# EasyEDA Pro project Schematic.epro

# Schematic Schematic1
Board Name: Board1; Create Date: 2026-08-19; Page Name: P1; Project Name: squid card; Schematic Name: Schematic1; Update Date: 2026-08-19; Company: EasyEDA.com; Page Size: A4; Version: V1.0
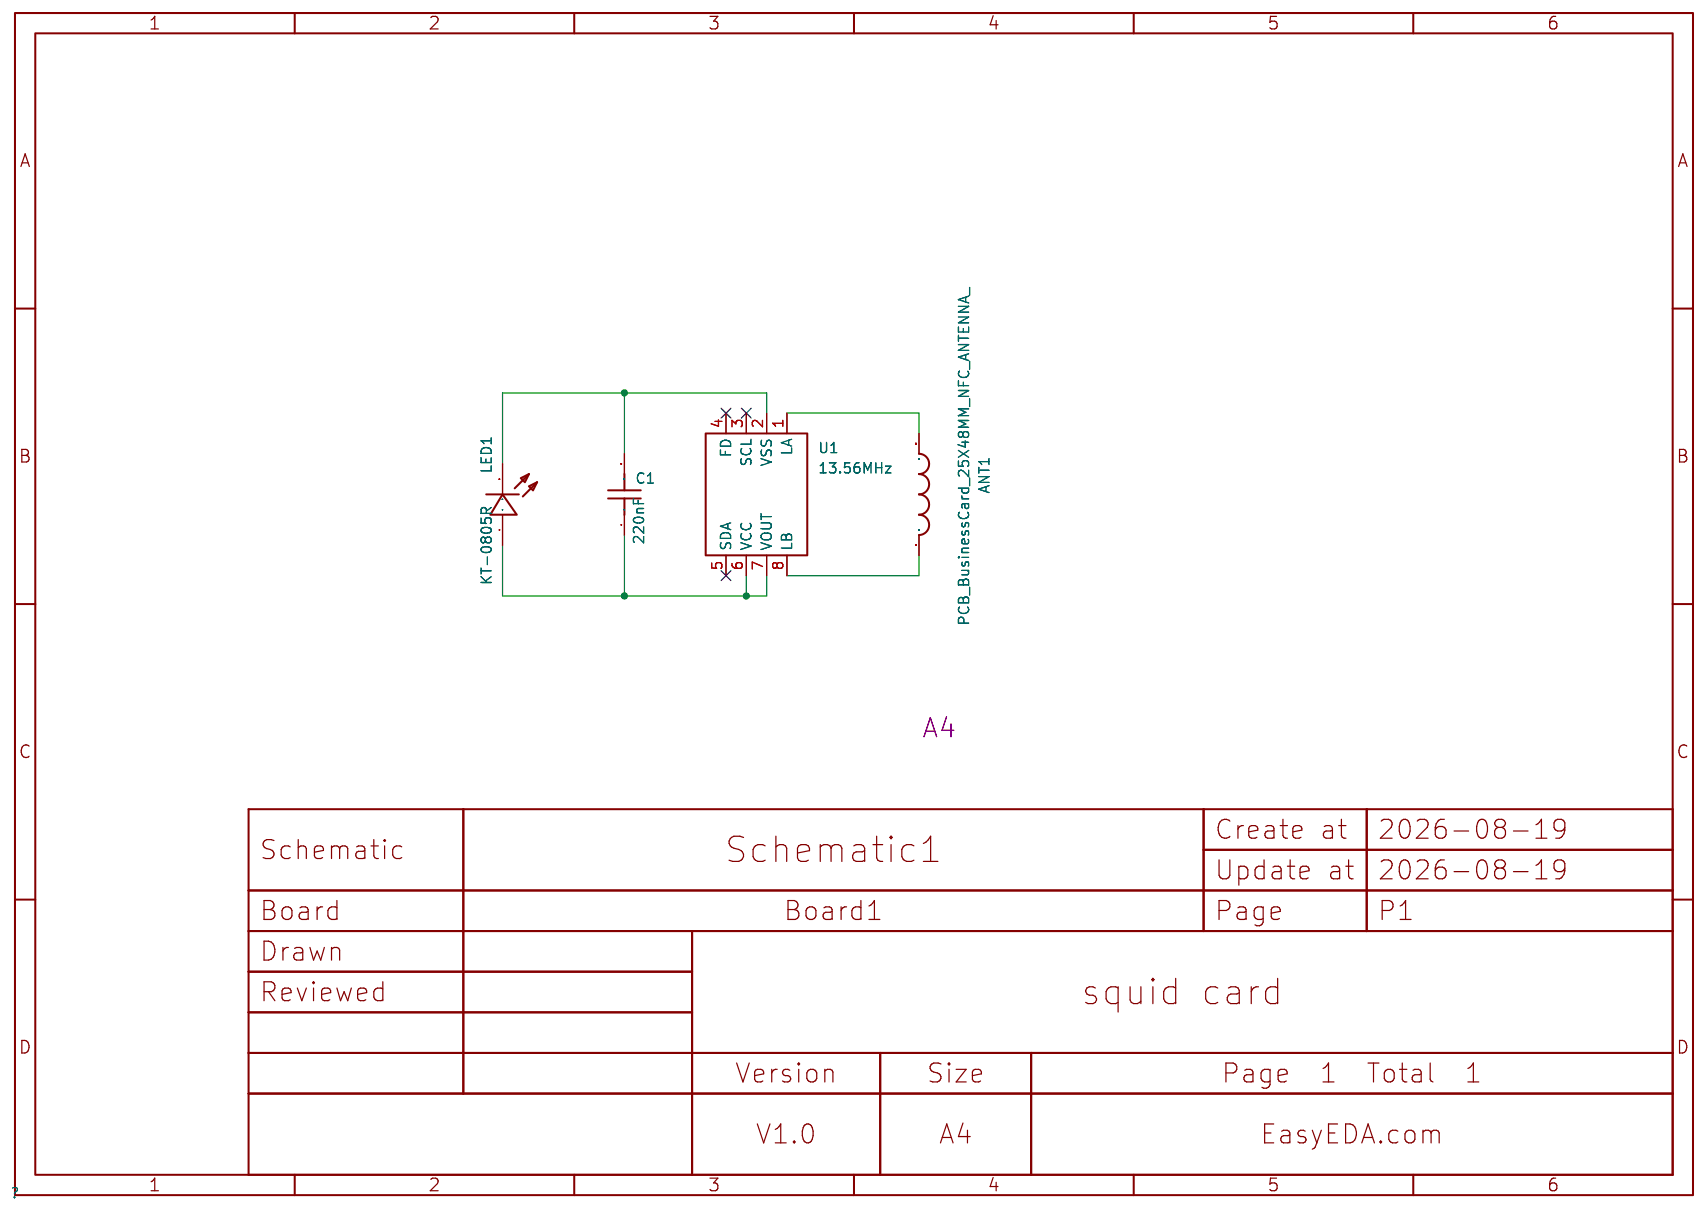
[diagram p0: schematic sheet]

## Parts
ANT1  PCB_BusinessCard_25X48MM_NFC_ANTENNA_  [25X48MM_NFC_ANTENNA]
C1  220nF  [C0603]
LED1  KT-0805R  [LED0805-FD_GL0805UG01]
U1  13.56MHz  [XQFN-8_L1.6-W1.6-P0.50-BL_NT3H2111W0FHKH]

## Library data of the parts
ANT1 = PCB_BusinessCard_25X48MM_NFC_ANTENNA_
C1 = CAP_0603: Supplier Footprint: 0603
LED1 = KT-0603R: Lamp Holder Type:1.6mm x 0.8mm square LED Illumination Color:Red Voltage - Forward(Vf):1.8V~2.4V Voltage - Forward(Vf):1.8V~2.4V Power(Watts):40mW Forward Current:20mA Wavelength - Dominant:615nm~630nm Wavelength - Dominant:615nm~630nm Peak Wavelength:645; LCSC Part Name: 0603 红灯 高亮; Supplier Part: C2286; Manufacturer: KENTO; Supplier Footprint: 0603; JLCPCB Part Class: Basic Part; Datasheet: https://item.szlcsc.com/datasheet/KT-0603R/2659.html; Supplier: LCSC; Lamp Holder Type: 1.6mm x 0.8mm square LED; Illumination Color: Red; Voltage - Forward(Vf): 1.8V~2.4V; Power(Watts): 40mW; Forward Current: 20mA; Wavelength - Dominant: 615nm~630nm; Peak Wavelength: 645nm; Diode Configuration: Discrete Diode; Lens Color: Water Clear; Luminous Intensity: 300mcd; Viewing Angle: 120°; Operating Temperature: -40℃~+85℃
U1 = NT3H2111W0FHKH: agreement:ISO 14443 interface type:I2C Frequency:13.56MHz Frequency:13.56MHz mains input:3.3V mains input:3.3V; Supplier Part: C710403; Manufacturer: NXP(恩智浦); Supplier Footprint: XQFN-8(1.6x1.6); JLCPCB Part Class: Extended Part; Datasheet: https://www.nxp.com/docs/en/data-sheet/NT3H2111_2211.pdf; Supplier: LCSC; agreement: ISO 14443; interface type: I2C; mains input: 3.3V

## Nets
Net-(ANT1-P$1): ANT1.P$1 U1.1(LA)
Net-(ANT1-P$2): ANT1.P$2 U1.8(LB)
Net-(C1-1): C1.1 LED1.1(A) U1.6(VCC) U1.7(VOUT)
Net-(C1-2): C1.2 LED1.2(K) U1.2(VSS)

Not connected (* = marked no-connect by the designer): U1 3(SCL)* 4(FD)* 5(SDA)*
